# Altium schematic sheet CR2032.SchDoc: CR2032 battery.
size 297 x 209 mm; Author: Dmitry Shpakov; Organization: NoName; Revision: Revision; SheetNumber: 9; SheetTotal: 11; PageSize: A4; ProjectName: Project Name
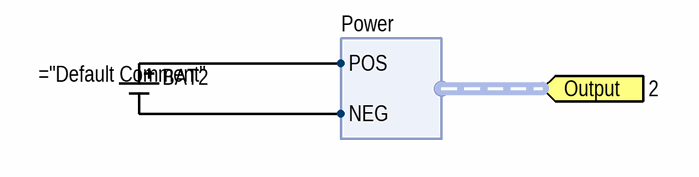
[diagram p0: CR2032.SchDoc]

## Parts
BAT2  (no value)

## Ports
Output (in, harness Power, see 2)

## Harnesses
Power: POS, NEG

## Nets
NetBAT2_NEG: BAT2.NEG ; port Output.NEG
NetBAT2_POS: BAT2.POS ; port Output.POS

## Notes on the sheet
- Author
- Date
- Organization
- Page
- Total pages
- Materials
- Page size

## Library data of the parts
BAT2 = BU2032SM-HD-G: BATT HOLDER COIN 20MM 1 CELL SMD; Manufacturer: MPD (Memory Protection Devices); Default Comment: CR2032; Power Dissipation: * W; Rated Voltage: * V; Rated Current: * A; Tolerance: * %; Other: Battery Holder (Open) Coin, 20.0mm 1 Cell SMD (SMT) Tab; Operating Temperature: -40 °C to +280 °C; Type: connector; HelpURL: https://www.digikey.com/en/products/detail/mpd-memory-protection-devices/BU2032SM-HD-G/755446; Rated Power: * W; Value: *; Summary: ="Type"+" "+"Part Number"+" "+"Manufacturer"+" "+"Value"+" "+"Tolerance"+" "+"Operating Temperature"+" "+"Case"+" "+"Power Dissipation"+" "+"Rated Current"+" "+"Rated Power"+" "+"Rated Voltage"+" "+"Other"; Assembly: *; Case: CR2032; Part Number: BU2032SM-HD-G